# Altium schematic sheet Sheet1.SchDoc
size A4
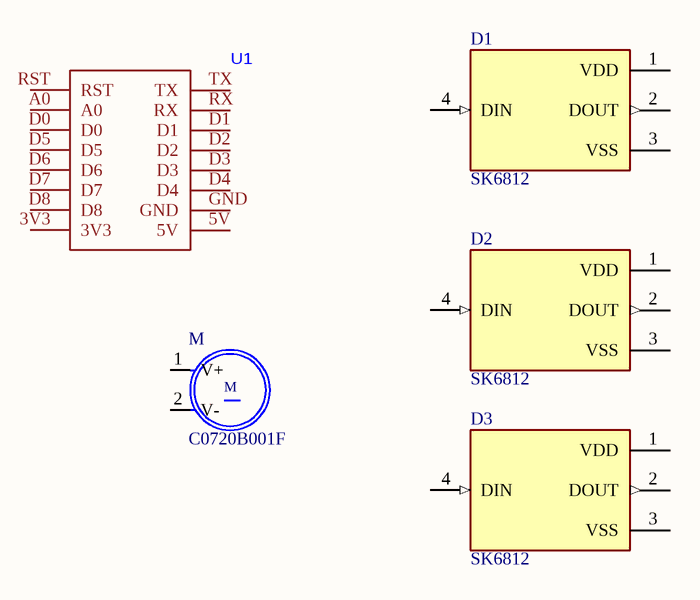
[diagram p0: Sheet1.SchDoc]

## Parts
D1  SK6812  [LED_SK6812]
D2  SK6812  [LED_SK6812]
D3  SK6812  [LED_SK6812]
M  C0720B001F  [XDCR_C0720B001F]
U1  (no value)  [WEMOS D1 MINI]

## Nets

Not connected (* = marked no-connect by the designer): D1 1(VDD) 2(DOUT) 3(VSS) 4(DIN); D2 1(VDD) 2(DOUT) 3(VSS) 4(DIN); D3 1(VDD) 2(DOUT) 3(VSS) 4(DIN); M 1(V+) 2(V-); U1 3V3 5V A0 D0 D1 D2 D3 D4 D5 D6 D7 D8 GND RST RX TX

## Library data of the parts
D1-D3 = SK6812: SMD 5050 Full color RGB LED data transmission frequency up to 800Kbps, with 30 fps refresh rate, 5.00x5.00 mm; MF: Shenzhen LED Color Optoelectronic Inc.; Package: SMD-4 Shenzhen LED Color Optoelectronic Inc.; Value: *; Check_prices: https://www.snapeda.com/parts/SK6812/Shenzhen%20LED%20Color%20Optoelectronic%20Inc./view-part/554016/?ref=eda; Price: None; Availability: Unavailable; MP: SK6812; SnapEDA_Link: https://www.snapeda.com/parts/SK6812/Shenzhen%20LED%20Color%20Optoelectronic%20Inc./view-part/554016/?ref=snap
M = C0720B001F: DC Motor Vibration, ERM 10000 RPM 3VDC; MF: Jinlong Machinery; Availability: Unavailable; SnapEDA_Link: https://www.snapeda.com/parts/C0720B001F/Jinlong%20Machinery%20%26%20Electronics%2C%20Inc./view-part/645169/?ref=snap; MP: C0720B001F; Value: *; Price: None; Package: Jinlong Machinery
U1 = WEMOS D1 MINI